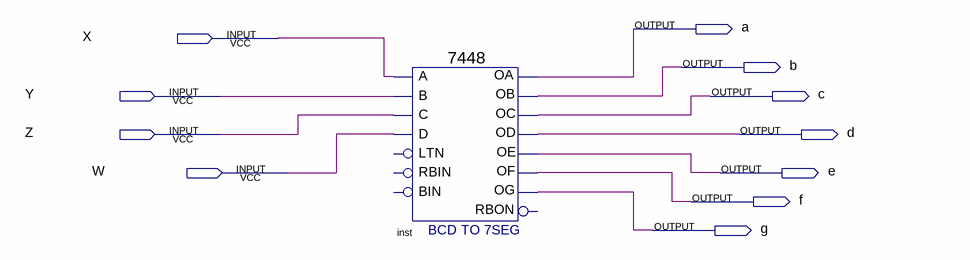
[diagram p0: schematic sheet]
// Quartus schematic SeteSegmentos.bdf as structural Verilog: 1 symbols, 11 pins
module SeteSegmentos (
  input  X,
  input  Y,
  input  Z,
  input  W,
  output a,
  output b,
  output c,
  output d,
  output e,
  output f,
  output g
);

  \7448  inst (
    .A(X), .C(Z), .D(W), .B(Y), .OC(c), .OE(e), .OD(d), .OF(f), .OG(g), .OB(b), .OA(a));  // open: RBIN, BIN, LTN, RBON
endmodule
